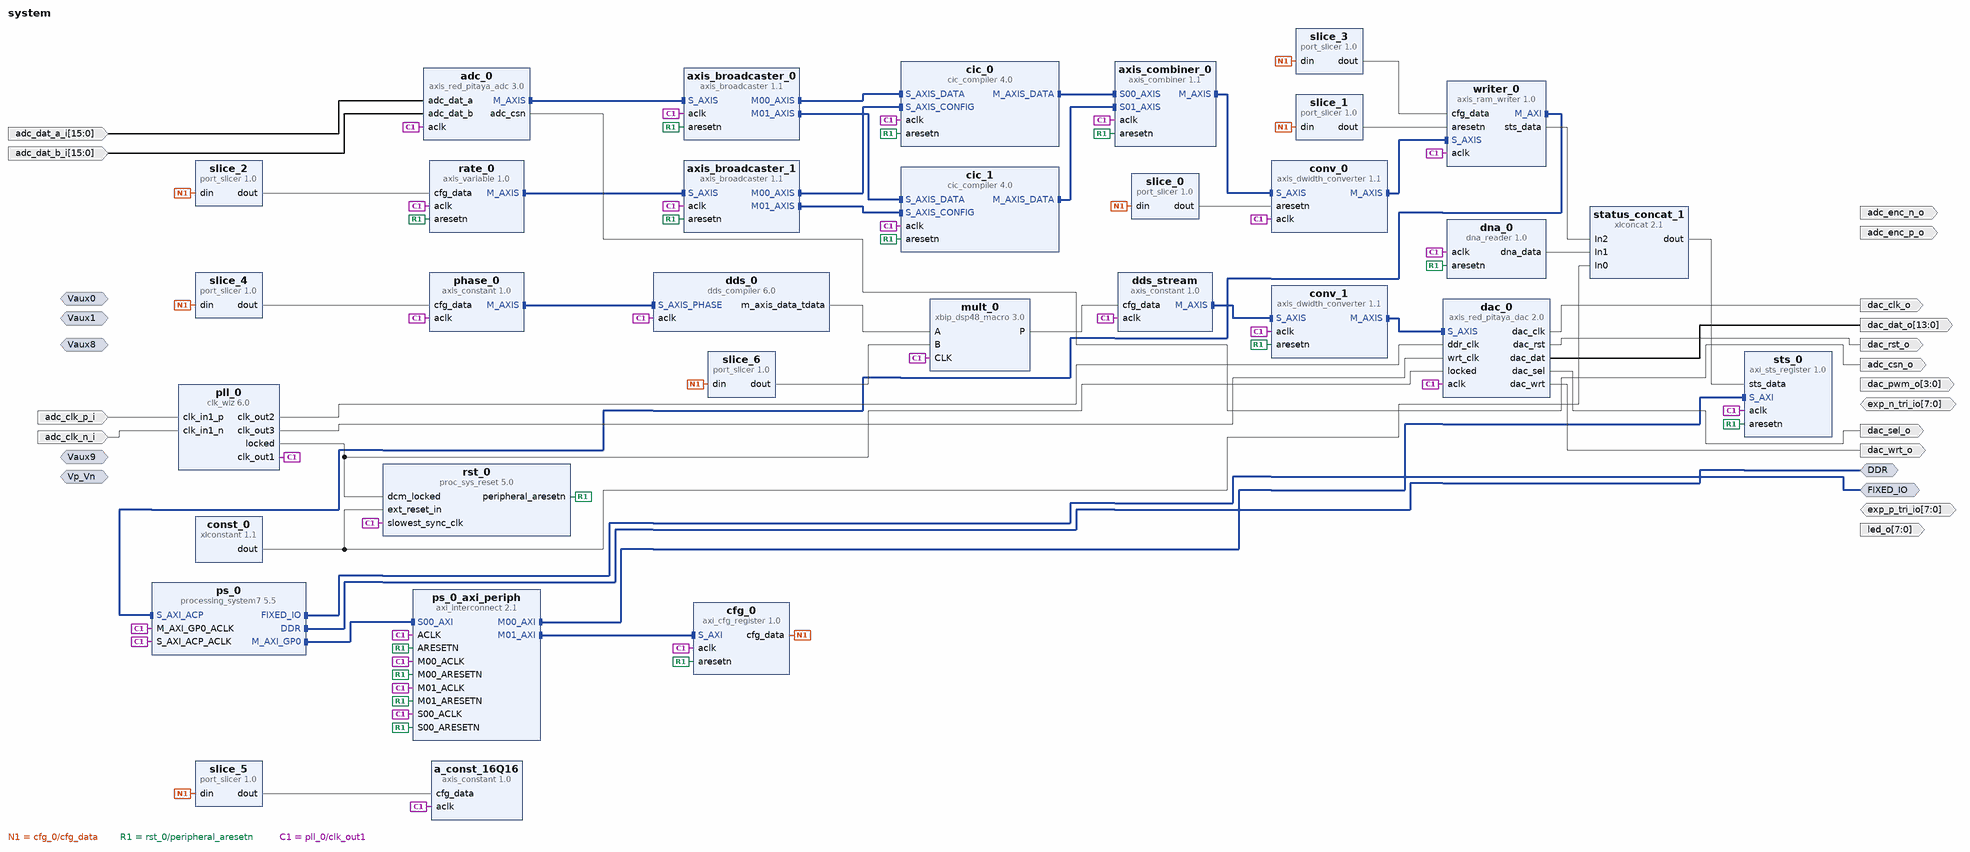
[diagram p0: block diagram of the top level]
# Vivado block design system, xc7z010clg400-1, Vivado 2020.2
create_bd_design system

create_bd_intf_port -mode Slave -vlnv xilinx.com:interface:diff_analog_io_rtl:1.0 Vp_Vn
create_bd_intf_port -mode Slave -vlnv xilinx.com:interface:diff_analog_io_rtl:1.0 Vaux0
create_bd_intf_port -mode Slave -vlnv xilinx.com:interface:diff_analog_io_rtl:1.0 Vaux1
create_bd_intf_port -mode Slave -vlnv xilinx.com:interface:diff_analog_io_rtl:1.0 Vaux9
create_bd_intf_port -mode Slave -vlnv xilinx.com:interface:diff_analog_io_rtl:1.0 Vaux8
create_bd_intf_port -mode Master -vlnv xilinx.com:interface:ddrx_rtl:1.0 DDR
create_bd_intf_port -mode Master -vlnv xilinx.com:display_processing_system7:fixedio_rtl:1.0 FIXED_IO
create_bd_port -dir I -from 15 -to 0 adc_dat_a_i
create_bd_port -dir I -from 15 -to 0 adc_dat_b_i
create_bd_port -dir I adc_clk_p_i
create_bd_port -dir I adc_clk_n_i
create_bd_port -dir O adc_enc_p_o
create_bd_port -dir O adc_enc_n_o
create_bd_port -dir O adc_csn_o
create_bd_port -dir O -from 13 -to 0 dac_dat_o
create_bd_port -dir O dac_clk_o
create_bd_port -dir O dac_rst_o
create_bd_port -dir O dac_sel_o
create_bd_port -dir O dac_wrt_o
create_bd_port -dir O -from 3 -to 0 dac_pwm_o
create_bd_port -dir IO -from 7 -to 0 exp_p_tri_io
create_bd_port -dir IO -from 7 -to 0 exp_n_tri_io
create_bd_port -dir O -from 7 -to 0 led_o

create_bd_cell -type ip -vlnv xilinx.com:ip:clk_wiz:6.0 pll_0
set_property -dict [list \
  CONFIG.CLKOUT1_REQUESTED_OUT_FREQ 125.0 \
  CONFIG.CLKOUT1_USED true \
  CONFIG.CLKOUT2_REQUESTED_OUT_FREQ 250.0 \
  CONFIG.CLKOUT2_REQUESTED_PHASE 157.5 \
  CONFIG.CLKOUT2_USED true \
  CONFIG.CLKOUT3_REQUESTED_OUT_FREQ 250.0 \
  CONFIG.CLKOUT3_REQUESTED_PHASE 202.5 \
  CONFIG.CLKOUT3_USED true \
  CONFIG.CLKOUT4_JITTER 119.348 \
  CONFIG.CLKOUT4_PHASE_ERROR 96.948 \
  CONFIG.CLKOUT4_REQUESTED_OUT_FREQ 125 \
  CONFIG.CLKOUT4_USED false \
  CONFIG.CLKOUT5_JITTER 119.348 \
  CONFIG.CLKOUT5_PHASE_ERROR 96.948 \
  CONFIG.CLKOUT5_REQUESTED_OUT_FREQ 125 \
  CONFIG.CLKOUT5_USED false \
  CONFIG.CLKOUT6_JITTER 119.348 \
  CONFIG.CLKOUT6_PHASE_ERROR 96.948 \
  CONFIG.CLKOUT6_REQUESTED_OUT_FREQ 125 \
  CONFIG.CLKOUT6_USED false \
  CONFIG.MMCM_CLKOUT3_DIVIDE 1 \
  CONFIG.MMCM_CLKOUT4_DIVIDE 1 \
  CONFIG.MMCM_CLKOUT5_DIVIDE 1 \
  CONFIG.NUM_OUT_CLKS 3 \
  CONFIG.PRIMITIVE PLL \
  CONFIG.PRIM_IN_FREQ 125.0 \
  CONFIG.PRIM_SOURCE Differential_clock_capable_pin \
  CONFIG.USE_RESET false \
] [get_bd_cells pll_0]
create_bd_cell -type ip -vlnv xilinx.com:ip:processing_system7:5.5 ps_0
set_property -dict [list \
  CONFIG.PCW_APU_PERIPHERAL_FREQMHZ 666.666666 \
  CONFIG.PCW_ENET0_ENET0_IO {MIO 16 .. 27} \
  CONFIG.PCW_ENET0_GRP_MDIO_ENABLE 1 \
  CONFIG.PCW_ENET0_GRP_MDIO_IO {MIO 52 .. 53} \
  CONFIG.PCW_ENET0_PERIPHERAL_ENABLE 1 \
  CONFIG.PCW_ENET0_RESET_ENABLE 0 \
  CONFIG.PCW_ENET_RESET_ENABLE 1 \
  CONFIG.PCW_ENET_RESET_SELECT {Share reset pin} \
  CONFIG.PCW_FPGA0_PERIPHERAL_FREQMHZ 50 \
  CONFIG.PCW_FPGA1_PERIPHERAL_FREQMHZ 50 \
  CONFIG.PCW_GPIO_EMIO_GPIO_ENABLE 1 \
  CONFIG.PCW_GPIO_EMIO_GPIO_IO 64 \
  CONFIG.PCW_GPIO_MIO_GPIO_ENABLE 1 \
  CONFIG.PCW_GPIO_MIO_GPIO_IO MIO \
  CONFIG.PCW_GPIO_PERIPHERAL_ENABLE 1 \
  CONFIG.PCW_I2C0_GRP_INT_ENABLE 0 \
  CONFIG.PCW_I2C0_I2C0_IO {MIO 50 .. 51} \
  CONFIG.PCW_I2C0_PERIPHERAL_ENABLE 1 \
  CONFIG.PCW_I2C_PERIPHERAL_FREQMHZ 111.111115 \
  CONFIG.PCW_I2C_RESET_ENABLE 1 \
  CONFIG.PCW_I2C_RESET_SELECT {Share reset pin} \
  CONFIG.PCW_IMPORT_BOARD_PRESET cfg/red_pitaya.xml \
  CONFIG.PCW_PRESET_BANK1_VOLTAGE {LVCMOS 2.5V} \
  CONFIG.PCW_QSPI_PERIPHERAL_ENABLE 0 \
  CONFIG.PCW_SD0_GRP_CD_ENABLE 1 \
  CONFIG.PCW_SD0_GRP_CD_IO {MIO 46} \
  CONFIG.PCW_SD0_GRP_WP_ENABLE 1 \
  CONFIG.PCW_SD0_GRP_WP_IO {MIO 47} \
  CONFIG.PCW_SD0_PERIPHERAL_ENABLE 1 \
  CONFIG.PCW_SD0_SD0_IO {MIO 40 .. 45} \
  CONFIG.PCW_SDIO_PERIPHERAL_FREQMHZ 100 \
  CONFIG.PCW_SPI0_PERIPHERAL_ENABLE 1 \
  CONFIG.PCW_SPI0_SPI0_IO EMIO \
  CONFIG.PCW_SPI1_PERIPHERAL_ENABLE 1 \
  CONFIG.PCW_SPI1_SPI1_IO {MIO 10 .. 15} \
  CONFIG.PCW_UART0_PERIPHERAL_ENABLE 1 \
  CONFIG.PCW_UART0_UART0_IO {MIO 14 .. 15} \
  CONFIG.PCW_UART1_PERIPHERAL_ENABLE 1 \
  CONFIG.PCW_UART1_UART1_IO {MIO 8 .. 9} \
  CONFIG.PCW_UART_PERIPHERAL_FREQMHZ 100 \
  CONFIG.PCW_UIPARAM_DDR_BUS_WIDTH {16 Bit} \
  CONFIG.PCW_UIPARAM_DDR_FREQ_MHZ 533.333333 \
  CONFIG.PCW_UIPARAM_DDR_PARTNO {MT41J256M16 RE-125} \
  CONFIG.PCW_USB0_PERIPHERAL_ENABLE 1 \
  CONFIG.PCW_USB0_RESET_ENABLE 1 \
  CONFIG.PCW_USB0_RESET_IO {MIO 48} \
  CONFIG.PCW_USB0_USB0_IO {MIO 28 .. 39} \
  CONFIG.PCW_USB_RESET_ENABLE 1 \
  CONFIG.PCW_USB_RESET_SELECT {Share reset pin} \
  CONFIG.PCW_USE_DEFAULT_ACP_USER_VAL 1 \
  CONFIG.PCW_USE_S_AXI_ACP 1 \
] [get_bd_cells ps_0]
# 429 more settings of ps_0 are not shown: defaults, MIO pin electricals, DDR timing, and values the tool derives
create_bd_cell -type ip -vlnv xilinx.com:ip:xlconstant:1.1 const_0
create_bd_cell -type ip -vlnv xilinx.com:ip:proc_sys_reset:5.0 rst_0
create_bd_cell -type ip -vlnv pavel-demin:user:axis_red_pitaya_adc:3.0 adc_0
set_property -dict {CONFIG.ADC_DATA_WIDTH 14} [get_bd_cells adc_0]
create_bd_cell -type ip -vlnv pavel-demin:user:axis_red_pitaya_dac:2.0 dac_0
set_property -dict {CONFIG.DAC_DATA_WIDTH 14} [get_bd_cells dac_0]
create_bd_cell -type ip -vlnv pavel-demin:user:axi_cfg_register:1.0 cfg_0
set_property -dict {CONFIG.AXI_ADDR_WIDTH 32 CONFIG.AXI_DATA_WIDTH 32 CONFIG.CFG_DATA_WIDTH 160} [get_bd_cells cfg_0]
create_bd_cell -type ip -vlnv pavel-demin:user:port_slicer:1.0 slice_0
set_property -dict {CONFIG.DIN_FROM 0 CONFIG.DIN_TO 0 CONFIG.DIN_WIDTH 160} [get_bd_cells slice_0]
create_bd_cell -type ip -vlnv pavel-demin:user:port_slicer:1.0 slice_1
set_property -dict {CONFIG.DIN_FROM 1 CONFIG.DIN_TO 1 CONFIG.DIN_WIDTH 160} [get_bd_cells slice_1]
create_bd_cell -type ip -vlnv pavel-demin:user:port_slicer:1.0 slice_2
set_property -dict {CONFIG.DIN_FROM 31 CONFIG.DIN_TO 16 CONFIG.DIN_WIDTH 160} [get_bd_cells slice_2]
create_bd_cell -type ip -vlnv pavel-demin:user:port_slicer:1.0 slice_3
set_property -dict {CONFIG.DIN_FROM 63 CONFIG.DIN_TO 32 CONFIG.DIN_WIDTH 160} [get_bd_cells slice_3]
create_bd_cell -type ip -vlnv pavel-demin:user:axis_variable:1.0 rate_0
set_property -dict {CONFIG.AXIS_TDATA_WIDTH 16} [get_bd_cells rate_0]
create_bd_cell -type ip -vlnv xilinx.com:ip:cic_compiler:4.0 cic_0
set_property -dict [list \
  CONFIG.Clock_Frequency 125 \
  CONFIG.Filter_Type Decimation \
  CONFIG.Fixed_Or_Initial_Rate 4 \
  CONFIG.HAS_ARESETN true \
  CONFIG.Input_Data_Width 16 \
  CONFIG.Input_Sample_Frequency 125 \
  CONFIG.Maximum_Rate 6250 \
  CONFIG.Minimum_Rate 4 \
  CONFIG.Number_Of_Stages 6 \
  CONFIG.Output_Data_Width 16 \
  CONFIG.Quantization Truncation \
  CONFIG.Sample_Rate_Changes Programmable \
  CONFIG.Use_Xtreme_DSP_Slice false \
] [get_bd_cells cic_0]
create_bd_cell -type ip -vlnv xilinx.com:ip:axis_dwidth_converter:1.1 conv_0
set_property -dict {CONFIG.M_TDATA_NUM_BYTES 8 CONFIG.S_TDATA_NUM_BYTES 4} [get_bd_cells conv_0]
create_bd_cell -type ip -vlnv pavel-demin:user:axis_ram_writer:1.0 writer_0
set_property -dict {CONFIG.ADDR_WIDTH 16 CONFIG.AXI_ID_WIDTH 3} [get_bd_cells writer_0]
create_bd_cell -type ip -vlnv pavel-demin:user:port_slicer:1.0 slice_4
set_property -dict {CONFIG.DIN_FROM 95 CONFIG.DIN_TO 64 CONFIG.DIN_WIDTH 160} [get_bd_cells slice_4]
create_bd_cell -type ip -vlnv pavel-demin:user:port_slicer:1.0 slice_6
set_property -dict {CONFIG.DIN_FROM 143 CONFIG.DIN_TO 128 CONFIG.DIN_WIDTH 160} [get_bd_cells slice_6]
create_bd_cell -type ip -vlnv pavel-demin:user:axis_constant:1.0 phase_0
set_property -dict {CONFIG.AXIS_TDATA_WIDTH 32} [get_bd_cells phase_0]
create_bd_cell -type ip -vlnv xilinx.com:ip:dds_compiler:6.0 dds_0
set_property -dict [list \
  CONFIG.DDS_Clock_Rate 125 \
  CONFIG.DSP48_Use Minimal \
  CONFIG.Frequency_Resolution 0.2 \
  CONFIG.Has_Phase_Out false \
  CONFIG.Negative_Sine true \
  CONFIG.Output_Width 24 \
  CONFIG.Phase_Increment Streaming \
  CONFIG.Phase_Width 30 \
  CONFIG.Spurious_Free_Dynamic_Range 138 \
] [get_bd_cells dds_0]
create_bd_cell -type ip -vlnv xilinx.com:ip:xbip_dsp48_macro:3.0 mult_0
set_property -dict [list \
  CONFIG.a_binarywidth 0 \
  CONFIG.a_width 24 \
  CONFIG.areg_3 true \
  CONFIG.areg_4 true \
  CONFIG.b_binarywidth 0 \
  CONFIG.b_width 16 \
  CONFIG.breg_3 true \
  CONFIG.breg_4 true \
  CONFIG.c_binarywidth 0 \
  CONFIG.cinreg_3 false \
  CONFIG.cinreg_4 false \
  CONFIG.cinreg_5 false \
  CONFIG.concat_binarywidth 0 \
  CONFIG.concat_width 48 \
  CONFIG.d_width 18 \
  CONFIG.instruction1 {RNDSIMPLE(A*B)} \
  CONFIG.mreg_5 true \
  CONFIG.output_properties User_Defined \
  CONFIG.p_width 15 \
  CONFIG.pcin_binarywidth 0 \
  CONFIG.preg_6 true \
] [get_bd_cells mult_0]
create_bd_cell -type ip -vlnv pavel-demin:user:port_slicer:1.0 slice_5
set_property -dict {CONFIG.DIN_FROM 127 CONFIG.DIN_TO 96 CONFIG.DIN_WIDTH 160} [get_bd_cells slice_5]
create_bd_cell -type ip -vlnv pavel-demin:user:axis_constant:1.0 a_const_16Q16
set_property -dict {CONFIG.AXIS_TDATA_WIDTH 32} [get_bd_cells a_const_16Q16]
create_bd_cell -type ip -vlnv pavel-demin:user:dna_reader:1.0 dna_0
create_bd_cell -type ip -vlnv xilinx.com:ip:xlconcat:2.1 status_concat_1
set_property -dict {CONFIG.IN0_WIDTH 32 CONFIG.IN1_WIDTH 64 CONFIG.IN2_WIDTH 32 CONFIG.NUM_PORTS 3} [get_bd_cells status_concat_1]
create_bd_cell -type ip -vlnv pavel-demin:user:axi_sts_register:1.0 sts_0
set_property -dict {CONFIG.AXI_ADDR_WIDTH 32 CONFIG.AXI_DATA_WIDTH 32 CONFIG.STS_DATA_WIDTH 128} [get_bd_cells sts_0]
create_bd_cell -type ip -vlnv xilinx.com:ip:axi_interconnect:2.1 ps_0_axi_periph
set_property -dict {CONFIG.NUM_MI 2} [get_bd_cells ps_0_axi_periph]
create_bd_cell -type ip -vlnv pavel-demin:user:axis_constant:1.0 dds_stream
set_property -dict {CONFIG.AXIS_TDATA_WIDTH 16} [get_bd_cells dds_stream]
create_bd_cell -type ip -vlnv xilinx.com:ip:axis_dwidth_converter:1.1 conv_1
set_property -dict {CONFIG.M_TDATA_NUM_BYTES 4 CONFIG.S_TDATA_NUM_BYTES 2} [get_bd_cells conv_1]
create_bd_cell -type ip -vlnv xilinx.com:ip:axis_broadcaster:1.1 axis_broadcaster_0
set_property -dict [list \
  CONFIG.M00_TDATA_REMAP {tdata[31:16]} \
  CONFIG.M01_TDATA_REMAP {tdata[15:0]} \
  CONFIG.M_TDATA_NUM_BYTES 2 \
  CONFIG.S_TDATA_NUM_BYTES 4 \
] [get_bd_cells axis_broadcaster_0]
create_bd_cell -type ip -vlnv xilinx.com:ip:cic_compiler:4.0 cic_1
set_property -dict [list \
  CONFIG.Clock_Frequency 125 \
  CONFIG.Filter_Type Decimation \
  CONFIG.Fixed_Or_Initial_Rate 4 \
  CONFIG.HAS_ARESETN true \
  CONFIG.Input_Data_Width 16 \
  CONFIG.Input_Sample_Frequency 125 \
  CONFIG.Maximum_Rate 6250 \
  CONFIG.Minimum_Rate 4 \
  CONFIG.Number_Of_Stages 6 \
  CONFIG.Output_Data_Width 16 \
  CONFIG.Quantization Truncation \
  CONFIG.Sample_Rate_Changes Programmable \
  CONFIG.Use_Xtreme_DSP_Slice false \
] [get_bd_cells cic_1]
create_bd_cell -type ip -vlnv xilinx.com:ip:axis_broadcaster:1.1 axis_broadcaster_1
set_property -dict [list \
  CONFIG.M00_TDATA_REMAP {tdata[15:0]} \
  CONFIG.M01_TDATA_REMAP {tdata[15:0]} \
  CONFIG.M_TDATA_NUM_BYTES 2 \
  CONFIG.S_TDATA_NUM_BYTES 2 \
] [get_bd_cells axis_broadcaster_1]
create_bd_cell -type ip -vlnv xilinx.com:ip:axis_combiner:1.1 axis_combiner_0
set_property -dict {CONFIG.TDATA_NUM_BYTES 2} [get_bd_cells axis_combiner_0]

# ---- connections ----

connect_bd_intf_net [get_bd_intf_pins axis_broadcaster_1/S_AXIS] [get_bd_intf_pins rate_0/M_AXIS]
connect_bd_intf_net [get_bd_intf_pins axis_broadcaster_1/M00_AXIS] [get_bd_intf_pins cic_0/S_AXIS_CONFIG]
connect_bd_intf_net [get_bd_intf_pins axis_broadcaster_0/M00_AXIS] [get_bd_intf_pins cic_0/S_AXIS_DATA]
connect_bd_intf_net [get_bd_intf_pins axis_broadcaster_0/M01_AXIS] [get_bd_intf_pins cic_1/S_AXIS_DATA]
connect_bd_intf_net [get_bd_intf_pins dds_0/S_AXIS_PHASE] [get_bd_intf_pins phase_0/M_AXIS]
connect_bd_intf_net [get_bd_intf_pins conv_1/M_AXIS] [get_bd_intf_pins dac_0/S_AXIS]
connect_bd_intf_net [get_bd_intf_pins writer_0/S_AXIS] [get_bd_intf_pins conv_0/M_AXIS]
connect_bd_intf_net [get_bd_intf_pins ps_0/M_AXI_GP0] [get_bd_intf_pins ps_0_axi_periph/S00_AXI]
connect_bd_intf_net [get_bd_intf_ports FIXED_IO] [get_bd_intf_pins ps_0/FIXED_IO]
connect_bd_intf_net [get_bd_intf_ports DDR] [get_bd_intf_pins ps_0/DDR]
connect_bd_intf_net [get_bd_intf_pins writer_0/M_AXI] [get_bd_intf_pins ps_0/S_AXI_ACP]
connect_bd_intf_net [get_bd_intf_pins ps_0_axi_periph/M01_AXI] [get_bd_intf_pins cfg_0/S_AXI]
connect_bd_intf_net [get_bd_intf_pins ps_0_axi_periph/M00_AXI] [get_bd_intf_pins sts_0/S_AXI]
connect_bd_intf_net [get_bd_intf_pins dds_stream/M_AXIS] [get_bd_intf_pins conv_1/S_AXIS]
connect_bd_intf_net [get_bd_intf_pins axis_broadcaster_1/M01_AXIS] [get_bd_intf_pins cic_1/S_AXIS_CONFIG]
connect_bd_intf_net [get_bd_intf_pins adc_0/M_AXIS] [get_bd_intf_pins axis_broadcaster_0/S_AXIS]
connect_bd_intf_net [get_bd_intf_pins cic_0/M_AXIS_DATA] [get_bd_intf_pins axis_combiner_0/S00_AXIS]
connect_bd_intf_net [get_bd_intf_pins cic_1/M_AXIS_DATA] [get_bd_intf_pins axis_combiner_0/S01_AXIS]
connect_bd_intf_net [get_bd_intf_pins conv_0/S_AXIS] [get_bd_intf_pins axis_combiner_0/M_AXIS]
connect_bd_net [get_bd_ports adc_clk_p_i] [get_bd_pins pll_0/clk_in1_p]
connect_bd_net [get_bd_ports adc_clk_n_i] [get_bd_pins pll_0/clk_in1_n]
connect_bd_net [get_bd_ports adc_dat_a_i] [get_bd_pins adc_0/adc_dat_a]
connect_bd_net [get_bd_ports adc_dat_b_i] [get_bd_pins adc_0/adc_dat_b]
connect_bd_net [get_bd_pins adc_0/adc_csn] [get_bd_ports adc_csn_o]
connect_bd_net [get_bd_pins pll_0/clk_out2] [get_bd_pins dac_0/ddr_clk]
connect_bd_net [get_bd_pins pll_0/clk_out3] [get_bd_pins dac_0/wrt_clk]
connect_bd_net [get_bd_pins pll_0/locked] [get_bd_pins dac_0/locked] [get_bd_pins rst_0/dcm_locked]
connect_bd_net [get_bd_pins dac_0/dac_clk] [get_bd_ports dac_clk_o]
connect_bd_net [get_bd_pins dac_0/dac_rst] [get_bd_ports dac_rst_o]
connect_bd_net [get_bd_pins dac_0/dac_sel] [get_bd_ports dac_sel_o]
connect_bd_net [get_bd_pins dac_0/dac_wrt] [get_bd_ports dac_wrt_o]
connect_bd_net [get_bd_pins dac_0/dac_dat] [get_bd_ports dac_dat_o]
connect_bd_net [get_bd_pins cfg_0/cfg_data] \
  [get_bd_pins slice_0/din] [get_bd_pins slice_1/din] [get_bd_pins slice_2/din] [get_bd_pins slice_3/din] \
  [get_bd_pins slice_4/din] [get_bd_pins slice_6/din] [get_bd_pins slice_5/din]
connect_bd_net [get_bd_pins rst_0/peripheral_aresetn] \
  [get_bd_pins rate_0/aresetn] [get_bd_pins cic_0/aresetn] [get_bd_pins dna_0/aresetn] \
  [get_bd_pins ps_0_axi_periph/S00_ARESETN] [get_bd_pins sts_0/aresetn] [get_bd_pins ps_0_axi_periph/M00_ARESETN] \
  [get_bd_pins ps_0_axi_periph/ARESETN] [get_bd_pins cfg_0/aresetn] [get_bd_pins ps_0_axi_periph/M01_ARESETN] \
  [get_bd_pins conv_1/aresetn] [get_bd_pins cic_1/aresetn] [get_bd_pins axis_combiner_0/aresetn] \
  [get_bd_pins axis_broadcaster_0/aresetn] [get_bd_pins axis_broadcaster_1/aresetn]
connect_bd_net [get_bd_pins slice_2/dout] [get_bd_pins rate_0/cfg_data]
connect_bd_net [get_bd_pins slice_0/dout] [get_bd_pins conv_0/aresetn]
connect_bd_net [get_bd_pins slice_3/dout] [get_bd_pins writer_0/cfg_data]
connect_bd_net [get_bd_pins slice_4/dout] [get_bd_pins phase_0/cfg_data]
connect_bd_net [get_bd_pins dds_0/m_axis_data_tdata] [get_bd_pins mult_0/A]
connect_bd_net [get_bd_pins slice_6/dout] [get_bd_pins mult_0/B]
connect_bd_net [get_bd_pins dna_0/dna_data] [get_bd_pins status_concat_1/In1]
connect_bd_net [get_bd_pins writer_0/sts_data] [get_bd_pins status_concat_1/In2]
connect_bd_net -net concat_1_dout [get_bd_pins status_concat_1/dout] [get_bd_pins sts_0/sts_data]
connect_bd_net [get_bd_pins pll_0/clk_out1] \
  [get_bd_pins ps_0_axi_periph/M01_ACLK] [get_bd_pins ps_0_axi_periph/M00_ACLK] [get_bd_pins ps_0_axi_periph/S00_ACLK] \
  [get_bd_pins ps_0_axi_periph/ACLK] [get_bd_pins rst_0/slowest_sync_clk] [get_bd_pins ps_0/S_AXI_ACP_ACLK] \
  [get_bd_pins ps_0/M_AXI_GP0_ACLK] [get_bd_pins cfg_0/aclk] [get_bd_pins sts_0/aclk] [get_bd_pins adc_0/aclk] \
  [get_bd_pins a_const_16Q16/aclk] [get_bd_pins cic_0/aclk] [get_bd_pins conv_0/aclk] [get_bd_pins rate_0/aclk] \
  [get_bd_pins dna_0/aclk] [get_bd_pins mult_0/CLK] [get_bd_pins phase_0/aclk] [get_bd_pins dds_0/aclk] \
  [get_bd_pins writer_0/aclk] [get_bd_pins dac_0/aclk] [get_bd_pins dds_stream/aclk] [get_bd_pins conv_1/aclk] \
  [get_bd_pins cic_1/aclk] [get_bd_pins axis_combiner_0/aclk] [get_bd_pins axis_broadcaster_0/aclk] \
  [get_bd_pins axis_broadcaster_1/aclk]
connect_bd_net [get_bd_pins slice_1/dout] [get_bd_pins writer_0/aresetn]
connect_bd_net [get_bd_pins const_0/dout] [get_bd_pins status_concat_1/In0] [get_bd_pins rst_0/ext_reset_in]
connect_bd_net [get_bd_pins mult_0/P] [get_bd_pins dds_stream/cfg_data]
connect_bd_net [get_bd_pins slice_5/dout] [get_bd_pins a_const_16Q16/cfg_data]

# ---- address map ----
assign_bd_address -offset 0x40000000 -range 4K -target_address_space [get_bd_addr_spaces ps_0/Data] [get_bd_addr_segs sts_0/s_axi/reg0]
assign_bd_address -offset 0x40001000 -range 4K -target_address_space [get_bd_addr_spaces ps_0/Data] [get_bd_addr_segs cfg_0/s_axi/reg0]
assign_bd_address -offset 0x00000000 -range 512M -target_address_space [get_bd_addr_spaces writer_0/M_AXI] [get_bd_addr_segs ps_0/S_AXI_ACP/ACP_DDR_LOWOCM]

set_property USER_COMMENTS.comment_0 Hardware
 [current_bd_design]
set_property USER_COMMENTS.comment_1 I/O
 [current_bd_design]
set_property USER_COMMENTS.comment_2 {Reg Breakout
} [current_bd_design]
set_property USER_COMMENTS.comment_3 {Processing/sig generation
} [current_bd_design]
set_property USER_COMMENTS.comment_4 {Demux output and DAC

} [current_bd_design]
set_property USER_COMMENTS.comment_5 {Save to RAM
} [current_bd_design]

validate_bd_design
save_bd_design
